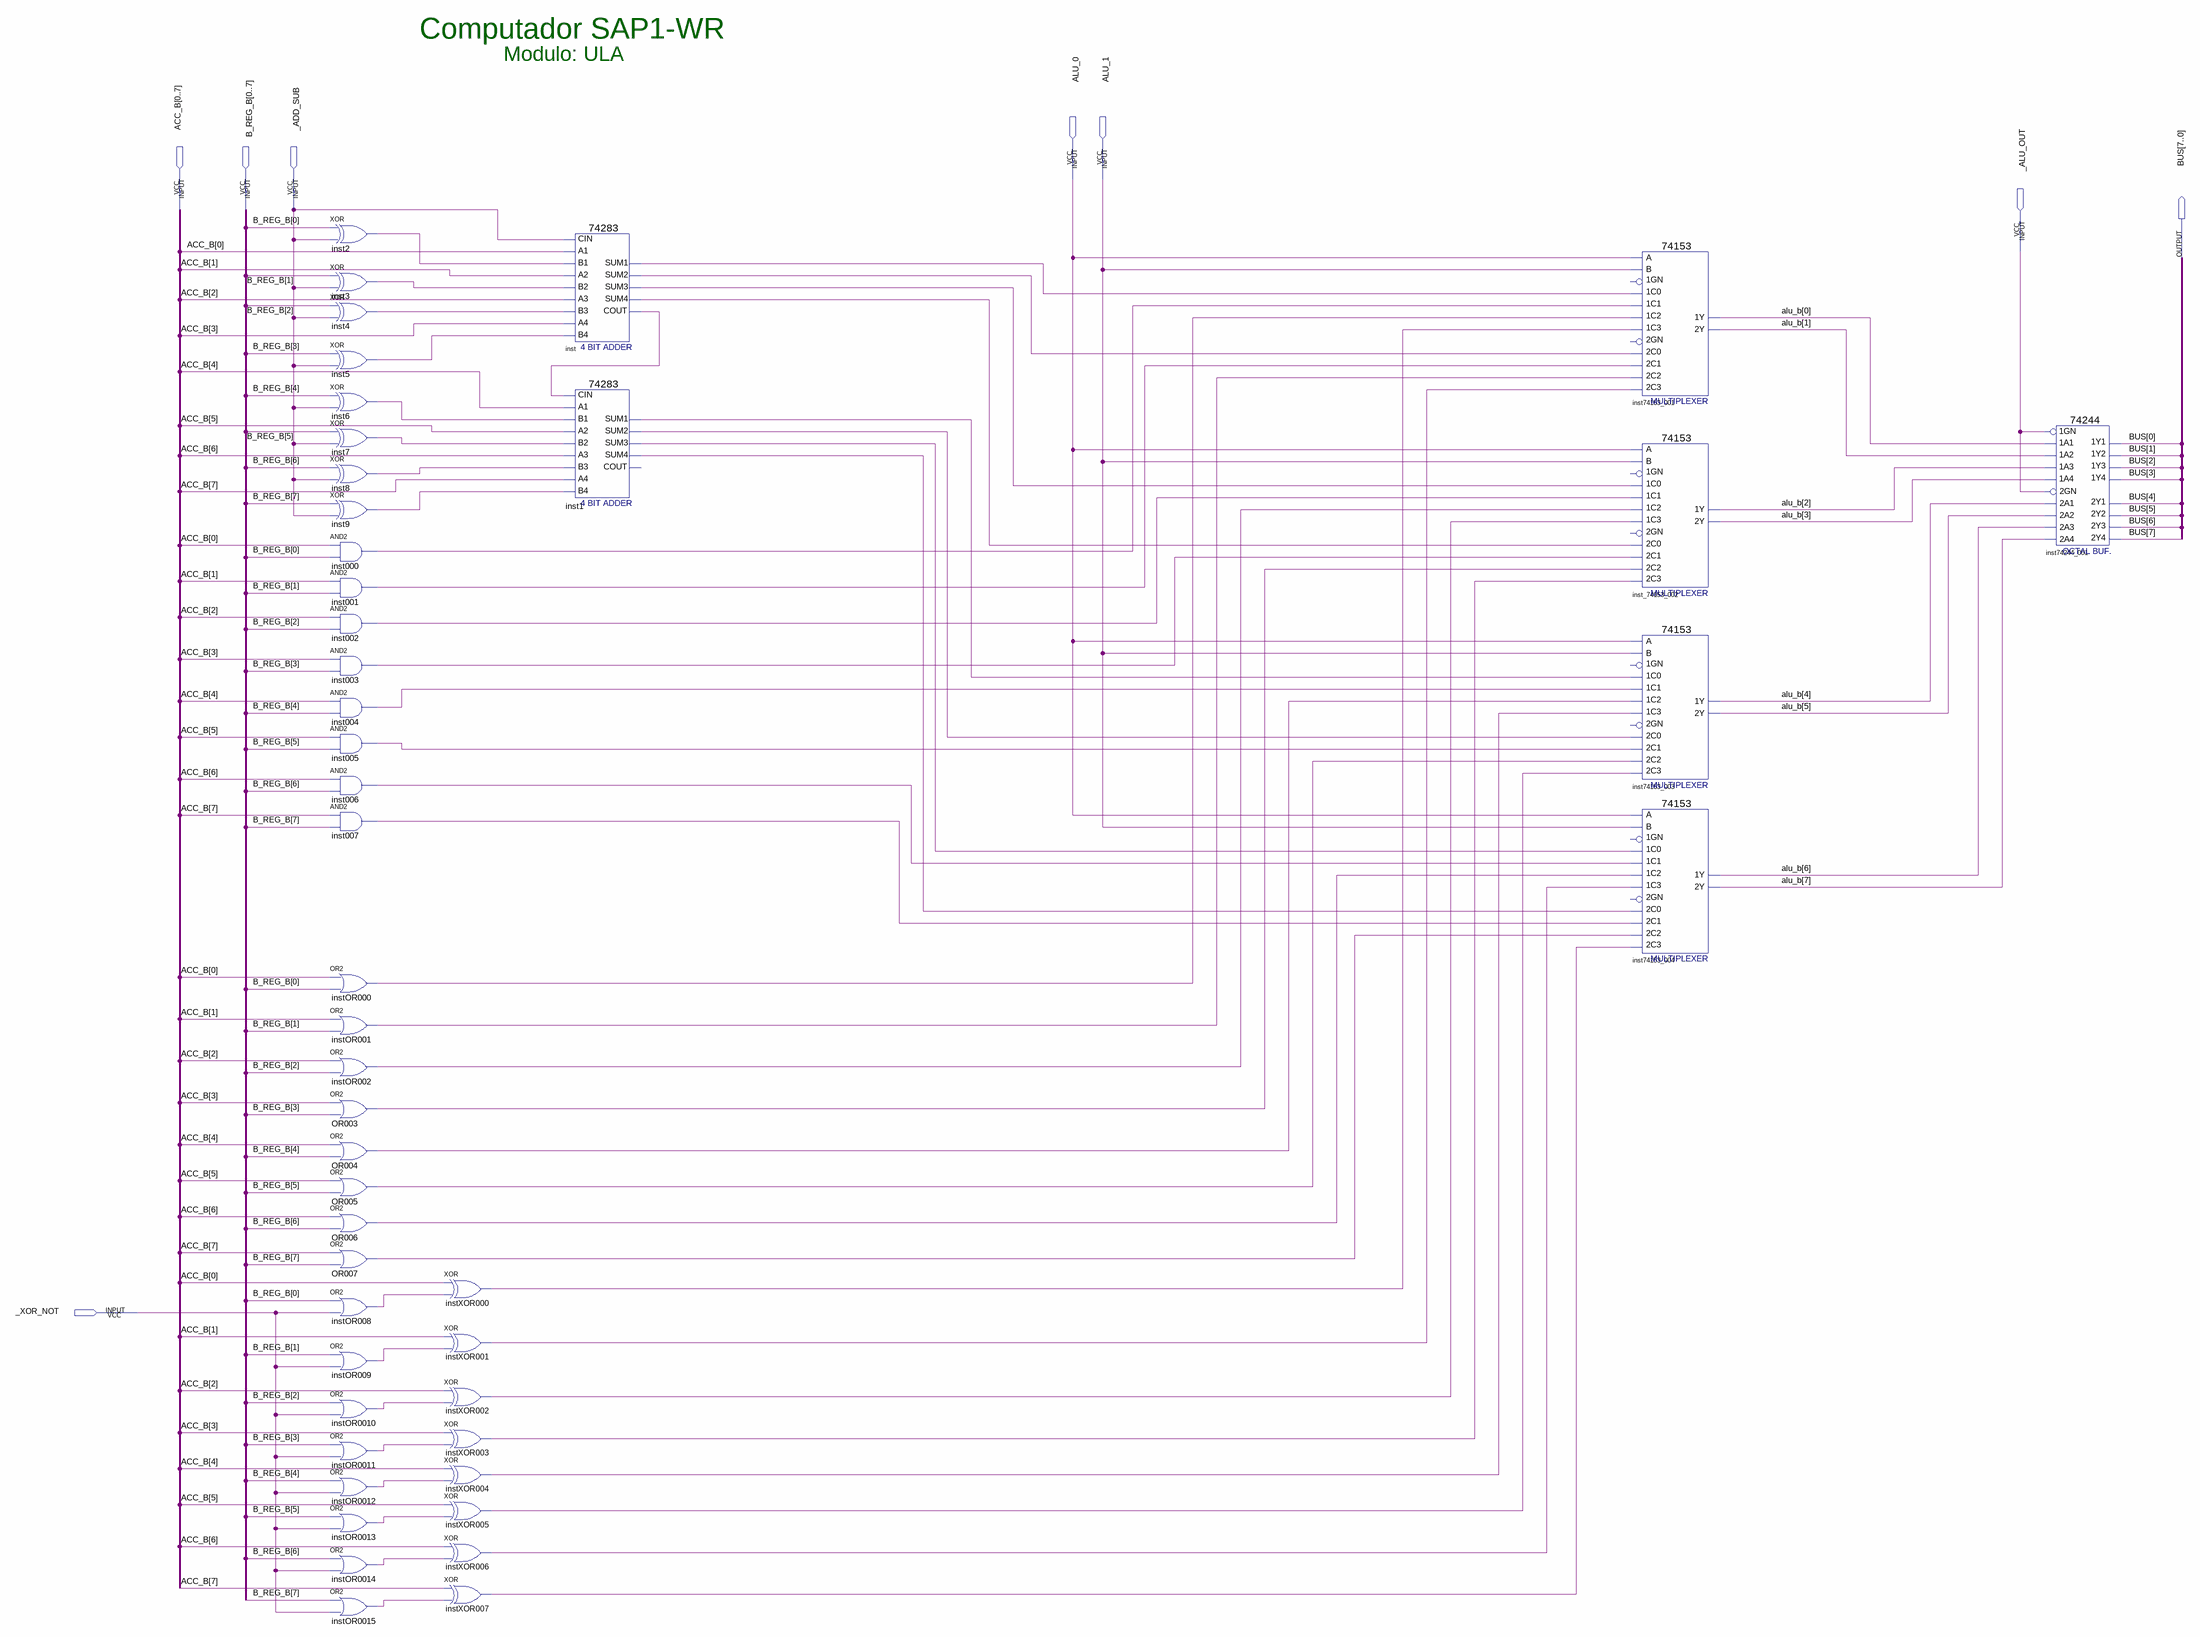
[diagram p0: schematic sheet]
// Quartus schematic ula.bdf as structural Verilog: 47 symbols, 8 pins
module ula (
  input  ALU_0,
  input  ALU_1,
  input  [0:7] ACC_B,
  input  [0:7] B_REG_B,
  input  _ADD_SUB,
  input  _ALU_OUT,
  input  _XOR_NOT,
  output [7:0] BUS
);

  wire inst000_out, inst001_out, inst1_sum1, inst1_sum2, inst1_sum3, inst1_sum4, inst2_out, inst002_out,
       inst3_out, inst003_out, inst4_out, inst004_out, inst5_out, inst005_out, inst6_out, inst006_out,
       inst7_out, inst007_out, inst8_out, inst9_out, inst_cout, inst_sum1, inst_sum2, inst_sum3, inst_sum4,
       instOR000_out, instOR001_out, instOR002_out, instOR008_out, instOR009_out, instOR0010_out,
       instOR0011_out, instOR0012_out, instOR0013_out, instOR0014_out, instOR0015_out, instXOR000_out,
       instXOR001_out, instXOR002_out, instXOR003_out, instXOR004_out, instXOR005_out, instXOR006_out,
       instXOR007_out, OR003_out, OR004_out, OR005_out, OR006_out, OR007_out;
  wire [7:0] alu_b;

  xor inst2 (inst2_out, B_REG_B[0], _ADD_SUB);
  xor inst3 (inst3_out, B_REG_B[1], _ADD_SUB);
  xor inst4 (inst4_out, B_REG_B[2], _ADD_SUB);
  xor inst5 (inst5_out, B_REG_B[3], _ADD_SUB);
  xor inst6 (inst6_out, B_REG_B[4], _ADD_SUB);
  xor inst7 (inst7_out, B_REG_B[5], _ADD_SUB);
  xor inst8 (inst8_out, B_REG_B[6], _ADD_SUB);
  xor inst9 (inst9_out, B_REG_B[7], _ADD_SUB);
  and inst000 (inst000_out, ACC_B[0], B_REG_B[0]);
  and inst001 (inst001_out, ACC_B[1], B_REG_B[1]);
  and inst002 (inst002_out, ACC_B[2], B_REG_B[2]);
  and inst003 (inst003_out, ACC_B[3], B_REG_B[3]);
  and inst004 (inst004_out, ACC_B[4], B_REG_B[4]);
  and inst005 (inst005_out, ACC_B[5], B_REG_B[5]);
  and inst006 (inst006_out, ACC_B[6], B_REG_B[6]);
  and inst007 (inst007_out, ACC_B[7], B_REG_B[7]);
  or instOR000 (instOR000_out, ACC_B[0], B_REG_B[0]);
  or instOR001 (instOR001_out, ACC_B[1], B_REG_B[1]);
  or instOR002 (instOR002_out, ACC_B[2], B_REG_B[2]);
  or OR003 (OR003_out, ACC_B[3], B_REG_B[3]);
  or OR004 (OR004_out, ACC_B[4], B_REG_B[4]);
  or OR005 (OR005_out, ACC_B[5], B_REG_B[5]);
  or OR006 (OR006_out, ACC_B[6], B_REG_B[6]);
  or OR007 (OR007_out, ACC_B[7], B_REG_B[7]);
  or instOR008 (instOR008_out, B_REG_B[0], _XOR_NOT);
  or instOR009 (instOR009_out, B_REG_B[1], _XOR_NOT);
  or instOR0010 (instOR0010_out, B_REG_B[2], _XOR_NOT);
  or instOR0011 (instOR0011_out, B_REG_B[3], _XOR_NOT);
  or instOR0012 (instOR0012_out, B_REG_B[4], _XOR_NOT);
  or instOR0013 (instOR0013_out, B_REG_B[5], _XOR_NOT);
  or instOR0014 (instOR0014_out, B_REG_B[6], _XOR_NOT);
  or instOR0015 (instOR0015_out, B_REG_B[7], _XOR_NOT);
  xor instXOR000 (instXOR000_out, ACC_B[0], instOR008_out);
  xor instXOR001 (instXOR001_out, ACC_B[1], instOR009_out);
  xor instXOR002 (instXOR002_out, ACC_B[2], instOR0010_out);
  xor instXOR003 (instXOR003_out, ACC_B[3], instOR0011_out);
  xor instXOR004 (instXOR004_out, ACC_B[4], instOR0012_out);
  xor instXOR005 (instXOR005_out, ACC_B[5], instOR0013_out);
  xor instXOR006 (instXOR006_out, ACC_B[6], instOR0014_out);
  xor instXOR007 (instXOR007_out, ACC_B[7], instOR0015_out);
  \74283  inst (
    .CIN(_ADD_SUB), .A1(ACC_B[0]), .A2(ACC_B[1]), .B2(inst3_out), .A3(ACC_B[2]), .A4(ACC_B[3]),
    .B4(inst5_out), .B1(inst2_out), .B3(inst4_out), .SUM4(inst_sum4), .COUT(inst_cout), .SUM1(inst_sum1),
    .SUM2(inst_sum2), .SUM3(inst_sum3));
  \74283  inst1 (
    .CIN(inst_cout), .A1(ACC_B[4]), .A2(ACC_B[5]), .B2(inst7_out), .A3(ACC_B[6]), .A4(ACC_B[7]),
    .B4(inst9_out), .B1(inst6_out), .B3(inst8_out), .SUM4(inst1_sum4), .SUM1(inst1_sum1), .SUM2(inst1_sum2),
    .SUM3(inst1_sum3));  // open: COUT
  \74153  inst74153_001 (
    .\1C1 (inst000_out), .\1C0 (inst_sum1), .\2C0 (inst_sum2), .\2C2 (instOR001_out), .\1C2 (instOR000_out),
    .\1C3 (instXOR000_out), .B(ALU_1), .A(ALU_0), .\2C1 (inst001_out), .\2C3 (instXOR001_out),
    .\1Y (alu_b[0]), .\2Y (alu_b[1]));  // open: 1GN, 2GN
  \74153  inst_74153_002 (
    .\1C1 (inst002_out), .\1C0 (inst_sum3), .\2C0 (inst_sum4), .\2C2 (OR003_out), .\1C2 (instOR002_out),
    .\1C3 (instXOR002_out), .B(ALU_1), .A(ALU_0), .\2C1 (inst003_out), .\2C3 (instXOR003_out),
    .\1Y (alu_b[2]), .\2Y (alu_b[3]));  // open: 1GN, 2GN
  \74153  inst74153_003 (
    .\1C1 (inst004_out), .\1C0 (inst1_sum1), .\2C0 (inst1_sum2), .\2C2 (OR005_out), .\1C2 (OR004_out),
    .\1C3 (instXOR004_out), .B(ALU_1), .A(ALU_0), .\2C1 (inst005_out), .\2C3 (instXOR005_out),
    .\1Y (alu_b[4]), .\2Y (alu_b[5]));  // open: 1GN, 2GN
  \74153  inst74153_004 (
    .\1C1 (inst006_out), .\1C0 (inst1_sum3), .\2C0 (inst1_sum4), .\2C2 (OR007_out), .\1C2 (OR006_out),
    .\1C3 (instXOR006_out), .B(ALU_1), .A(ALU_0), .\2C1 (inst007_out), .\2C3 (instXOR007_out),
    .\1Y (alu_b[6]), .\2Y (alu_b[7]));  // open: 1GN, 2GN
  \74244  inst74244_001 (
    .\1A2 (alu_b[1]), .\1A4 (alu_b[3]), .\1A1 (alu_b[0]), .\1A3 (alu_b[2]), .\1GN (_ALU_OUT),
    .\2A3 (alu_b[6]), .\2GN (_ALU_OUT), .\2A1 (alu_b[4]), .\2A4 (alu_b[7]), .\2A2 (alu_b[5]), .\1Y2 (BUS[1]),
    .\1Y4 (BUS[3]), .\2Y1 (BUS[4]), .\1Y1 (BUS[0]), .\2Y3 (BUS[6]), .\2Y4 (BUS[7]), .\1Y3 (BUS[2]),
    .\2Y2 (BUS[5]));

  // Notes on the sheet:
  //   Computador SAP1-WR
  //   Modulo: ULA
endmodule
